# EAGLE design TeslaBMS_Shield (EAGLE 6.6.0)
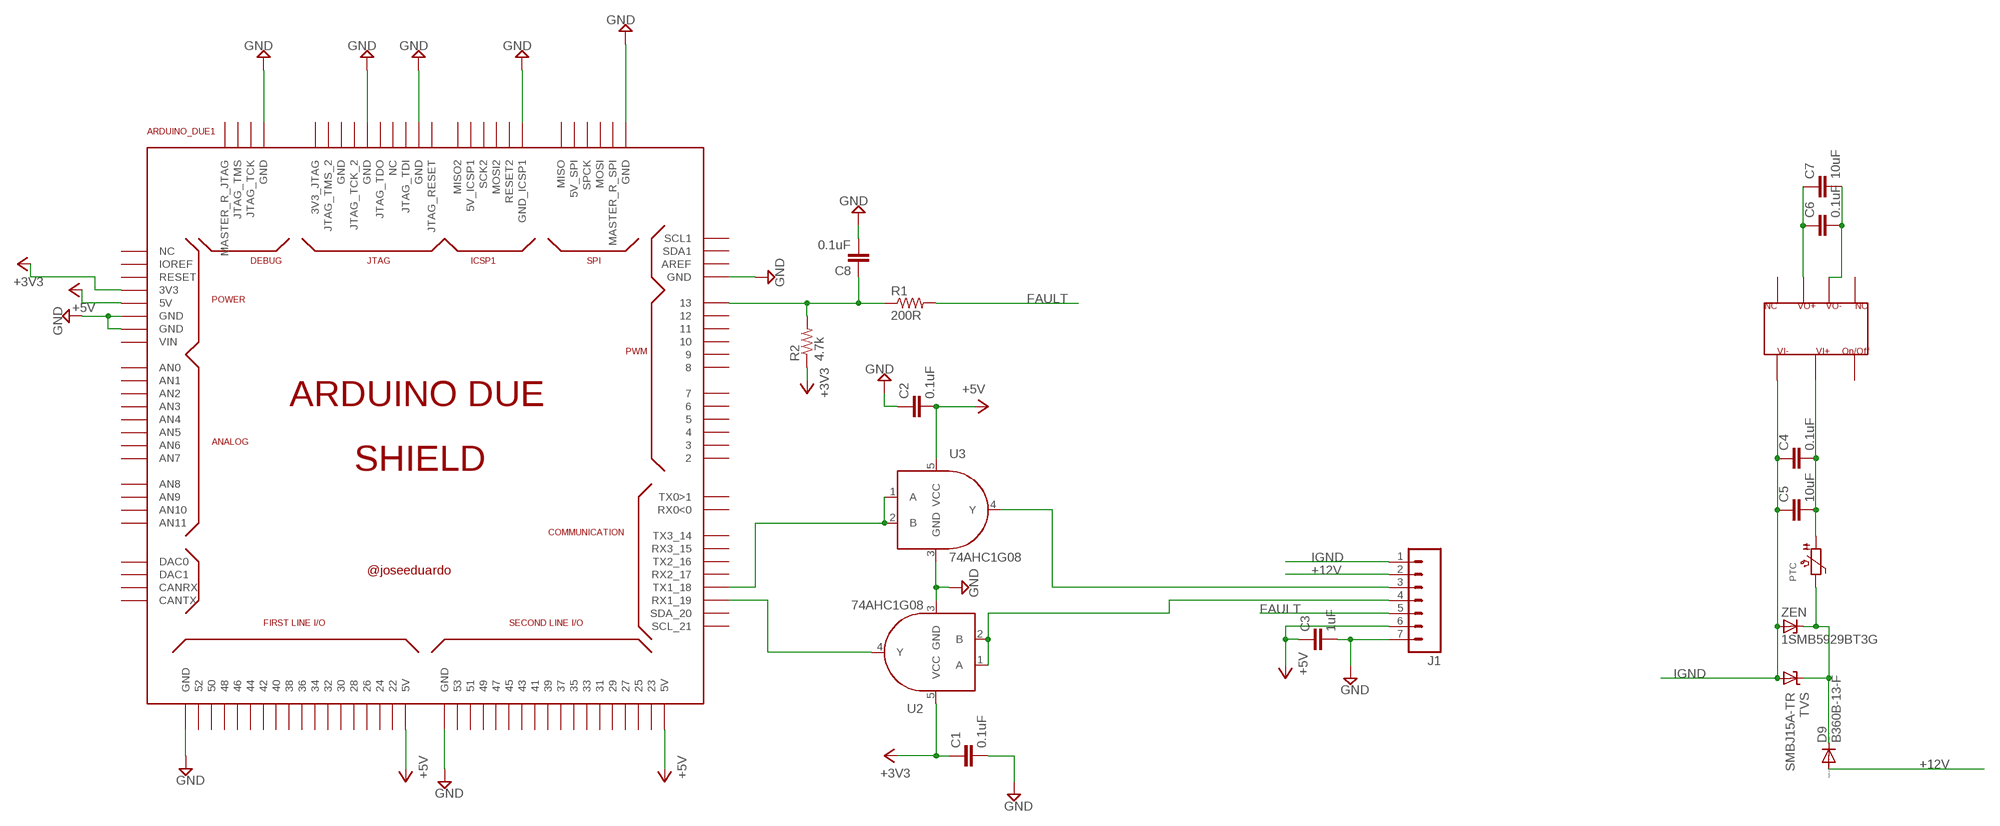
[diagram p0: schematic, sheet 1]

## Parts
ARDUINO_DUE1  ARDUINO_DUE_SHIELD  [ARDUINO_DUE_SHIELD]
C1  0.1uF  CAP0603-CAP  [0603-CAP]
C2  0.1uF  CAP0603-CAP  [0603-CAP]
C3  1uF  CAP0603-CAP  [0603-CAP]
C4  0.1uF  CAP0805  [0805]
C5  10uF  CAP0805  [0805]
C6  0.1uF  CAP0805  [0805]
C7  10uF  CAP0805  [0805]
C8  0.1uF  CAP0603-CAP  [0603-CAP]
D9  B360B-13-F  DIODE-SMB  [SMB]
J1  M07LONGPADS  [1X07_LONGPADS]
PTC  PTC1812  [PTC1812]
R1  200R  RESISTOR0603-RES  [0603-RES]
R2  4.7k  RESISTOR0603-RES  [0603-RES]
TVS  SMBJ15A-TR  SUPPRESSOR-SMBJ  [SMBJ]
U1  CINCON5V  [CINCON5V]
U2  74AHC1G08  [SOT353]
U3  74AHC1G08  [SOT353]
ZEN  1SMB5929BT3G  ZENER-DIODESMB  [SMB]

## Nets
+3V3: ARDUINO_DUE1.3V3 C1.1 R2.1 U2.5(VCC)
+5V: ARDUINO_DUE1.5V0(5V) ARDUINO_DUE1.5V0_1(5V) ARDUINO_DUE1.5V0_2(5V) C2.2 C3.1 C6.1 C7.1 J1.6 U1.P$5 U3.5(VCC)
+12V: D9.A J1.2
FAULT: J1.5 R1.2
GND: ARDUINO_DUE1.GND ARDUINO_DUE1.GND_1(GND) ARDUINO_DUE1.GND_2(GND) ARDUINO_DUE1.GND_3(GND) ARDUINO_DUE1.GND_4(GND) ARDUINO_DUE1.GND_5(GND) ARDUINO_DUE1.GND_7(GND) ARDUINO_DUE1.GND_9(GND) ARDUINO_DUE1.GND_10(GND) ARDUINO_DUE1.GND_ICSP1 C1.2 C2.1 C3.2 C6.2 C7.2 C8.2 J1.7 U1.P$6 U2.3(GND) U3.3(GND)
IGND: C4.1 C5.1 J1.1 TVS.A U1.P$1 ZEN.A
N$1: D9.C PTC.P$2 TVS.C ZEN.C
N$2: ARDUINO_DUE1.19(RX1_19) U2.4(Y)
N$3: ARDUINO_DUE1.18(TX1_18) U3.1(A) U3.2(B)
N$4: J1.3 U3.4(Y)
N$5: J1.4 U2.1(A) U2.2(B)
N$6: C4.2 C5.2 PTC.P$1 U1.P$2
N$7: ARDUINO_DUE1.13 C8.1 R1.1 R2.2
Unconnected: ARDUINO_DUE1.0(RX0<0) ARDUINO_DUE1.1(TX0>1) ARDUINO_DUE1.2 ARDUINO_DUE1.3 ARDUINO_DUE1.3V3_JTAG ARDUINO_DUE1.4 ARDUINO_DUE1.5 ARDUINO_DUE1.5V_2(5V_SPI) ARDUINO_DUE1.5V_ICSP1 ARDUINO_DUE1.6 ARDUINO_DUE1.7 ARDUINO_DUE1.8 ARDUINO_DUE1.9 ARDUINO_DUE1.10 ARDUINO_DUE1.11 ARDUINO_DUE1.12 ARDUINO_DUE1.14(TX3_14) ARDUINO_DUE1.15(RX3_15) ARDUINO_DUE1.16(TX2_16) ARDUINO_DUE1.17(RX2_17) ARDUINO_DUE1.20(SDA_20) ARDUINO_DUE1.21(SCL_21) ARDUINO_DUE1.22 ARDUINO_DUE1.23 ARDUINO_DUE1.24 ARDUINO_DUE1.25 ARDUINO_DUE1.26 ARDUINO_DUE1.27 ARDUINO_DUE1.28 ARDUINO_DUE1.29 ARDUINO_DUE1.30 ARDUINO_DUE1.31 ARDUINO_DUE1.32 ARDUINO_DUE1.33 ARDUINO_DUE1.34 ARDUINO_DUE1.35 ARDUINO_DUE1.36 ARDUINO_DUE1.37 ARDUINO_DUE1.38 ARDUINO_DUE1.39 ARDUINO_DUE1.40 ARDUINO_DUE1.41 ARDUINO_DUE1.42 ARDUINO_DUE1.43 ARDUINO_DUE1.44 ARDUINO_DUE1.45 ARDUINO_DUE1.46 ARDUINO_DUE1.47 ARDUINO_DUE1.48 ARDUINO_DUE1.49 ARDUINO_DUE1.50 ARDUINO_DUE1.51 ARDUINO_DUE1.52 ARDUINO_DUE1.53 ARDUINO_DUE1.A0(AN0) ARDUINO_DUE1.A1(AN1) ARDUINO_DUE1.A2(AN2) ARDUINO_DUE1.A3(AN3) ARDUINO_DUE1.A4(AN4) ARDUINO_DUE1.A5(AN5) ARDUINO_DUE1.A6(AN6) ARDUINO_DUE1.A7(AN7) ARDUINO_DUE1.A8(AN8) ARDUINO_DUE1.A9(AN9) ARDUINO_DUE1.A10(AN10) ARDUINO_DUE1.A11(AN11) ARDUINO_DUE1.AREF ARDUINO_DUE1.CANRX ARDUINO_DUE1.CANTX ARDUINO_DUE1.DAC0 ARDUINO_DUE1.DAC1 ARDUINO_DUE1.GND_8(GND) ARDUINO_DUE1.IOREF ARDUINO_DUE1.JTAG_RESET ARDUINO_DUE1.JTAG_TCK ARDUINO_DUE1.JTAG_TCK_2 ARDUINO_DUE1.JTAG_TDI ARDUINO_DUE1.JTAG_TDO ARDUINO_DUE1.JTAG_TMS ARDUINO_DUE1.JTAG_TMS_2 ARDUINO_DUE1.MASTER_RESET_JTAG(MASTER_R_JTAG) ARDUINO_DUE1.MASTER_RESET_SPI(MASTER_R_SPI) ARDUINO_DUE1.MISO ARDUINO_DUE1.MISO2 ARDUINO_DUE1.MOSI ARDUINO_DUE1.MOSI2 ARDUINO_DUE1.NC_2(NC) ARDUINO_DUE1.NC_5(NC) ARDUINO_DUE1.RESET ARDUINO_DUE1.RESET2 ARDUINO_DUE1.SCK2 ARDUINO_DUE1.SCL1 ARDUINO_DUE1.SDA1 ARDUINO_DUE1.SPCK ARDUINO_DUE1.VIN U1.P$3 U1.P$4 U1.P$7

## Library data of the parts
ARDUINO_DUE1 = arduino_due_shield:ARDUINO_DUE_SHIELD
C1-C8 = SparkFun-Passives:CAP: Capacitor Standard 0603 ceramic capacitor, and 0.1" leaded capacitor.
D9 = diode:DIODE-: DIODE
J1 = SparkFun-Connectors:M07: Header 7 Standard 7-pin 0.1" header. Use with straight break away headers (SKU : PRT-00116), right angle break away headers (PRT-00553), swiss pins (PRT-00743), machine pins (PRT-00117), and female headers (PRT-00115). NOTES ON THE VARIANTS LOCK and LOCK_LONGPADS... This footprint was designed to help hold the alignment of a through-hole component (i.e. 7-pin header) while soldering it into place. You may notice that each hole has been shifted either up or down by 0.005 of an inch from it's more standard position (which is usually a perfectly straight line). This slight alteration caused the pins (the squares in the middle) to touch the edges of the holes. Because they are alternating, it causes a "brace" to hold the header in place. 0.005 has proven to be the perfect amount of "off-center" position when using our standard breakaway headers. Although looks a little odd when you look at the bare footprint, once you have a header in there, the alteration is very hard to notice. Also, if you push a header all the way into place, it is covered up entirely on the bottom side. This idea of altering the position of holes to aid alignment will be further integrated into the Sparkfun Library for other footprints. It can help hold any component with 3 or more connection pins.
PTC = microbuilder:PTC: PTC (Resettable Fuse) 1206 Package 250mA PTC (16V Max, Time-to-Trip: 0.08s) - Digikey: F2110CT-ND 1210 Package 100mA PTC (30V Max, Time-to-Trip: 0.6s) - Digikey: MF-USMF010-2CT-ND 1812 Package 750mA PTC (24V Max, Time-to-Trip: 0.2s) - Digikey: MF-MSMF075/24-2CT-ND
R1 R2 = SparkFun-Passives:RESISTOR: Resistor Basic schematic elements and footprints for 0603, 1206, and PTH resistors.
TVS = diode:SUPPRESSOR-: Suppressor diode
U1 = collin:CINCON5V
U2 U3 = SparkFun-DigitalIC:74AHC1G08: Single 2-input AND gate; PROD_ID: IC-10841
ZEN = diode:ZENER-DIODE: Z-Diode

## Net classes
0 default: width 0.203 mm, drill 0.305 mm, clearance 0.203 mm

## Board
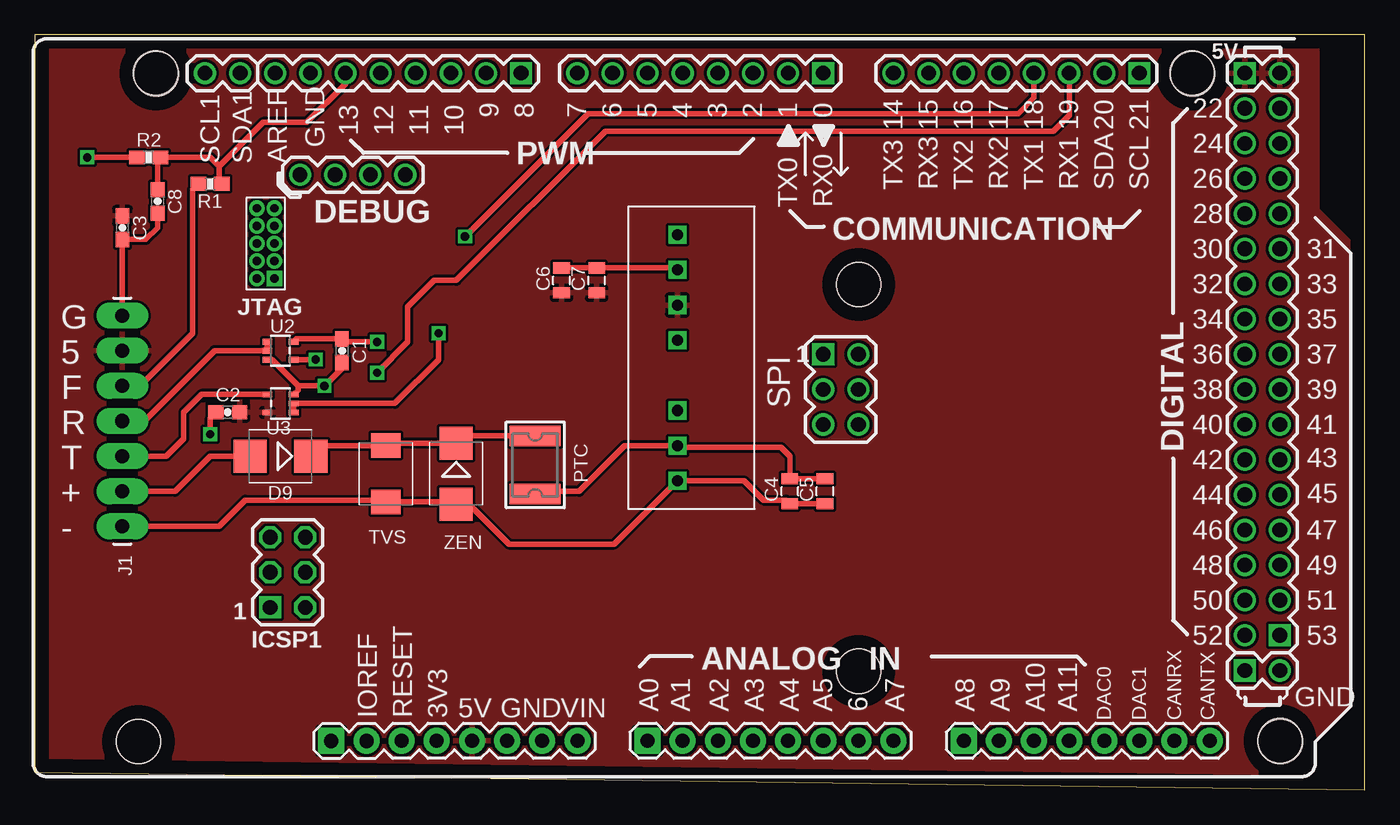
[diagram p1: board, top side]
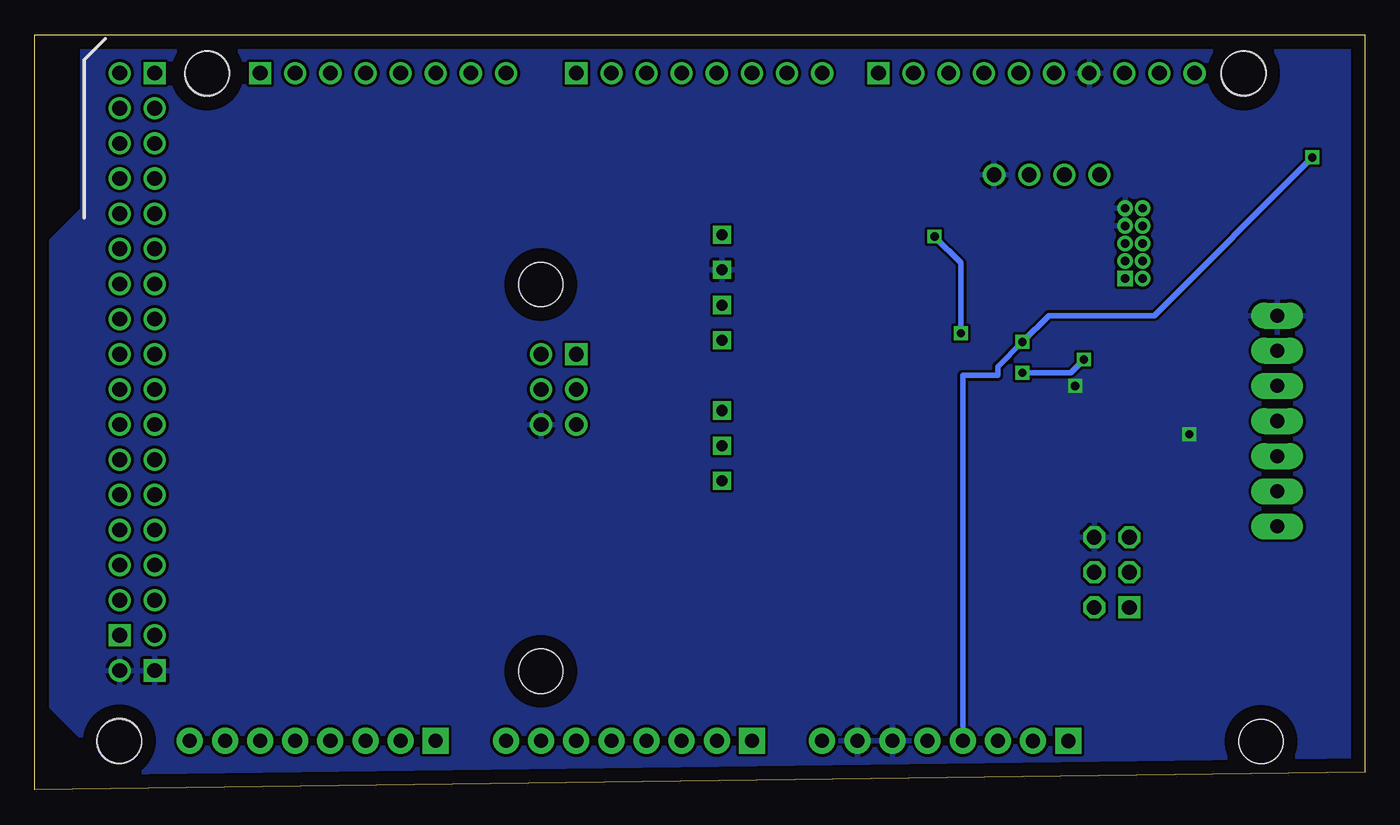
[diagram p2: board, bottom side, seen from below]

Size 96.19 x 54.6 mm. Coordinates in mm from the lower left corner, seen from the top.
Outline: 0,1.27 96.19,0 96.19,54.6 0,54.6 0,1.27
Copper layers (1*16): Top 0.035mm / dielectric 1.5mm / Bottom 0.035mm
Design rules "default": minimum track width 10mil, minimum drill 24mil, track to track 8mil, track to pad 8mil, pad to pad 8mil, via to via 8mil, smd to smd 8mil, copper to edge 40mil, drill to drill 8mil, minimum pad ring 10mil, minimum via ring 8mil, stop-mask expansion 4mil, vias tented up to drill 0mil, thermal gap 10mil

### Footprints (pad centres in the part's own frame; a part is rotated, then mirrored left to right if it is on the bottom)
ARDUINO_DUE_SHIELD = drill 1.067 square: 0 63.373,51.816; 5V0_1 93.853,51.816; 8 41.529,51.816; 21 86.233,51.816; 53 96.393,11.176; GND_2 93.853,8.636; MISO 63.373,31.496; MISO2 23.384,13.196 | drill 1.067: 1 60.833,51.816; 2 58.293,51.816; 3 55.753,51.816; 4 53.213,51.816; 5 50.673,51.816; 5V0_2 96.393,51.816; 5V_2 65.913,31.496; 6 48.133,51.816; 7 45.593,51.816; 9 38.989,51.816; 10 36.449,51.816; 11 33.909,51.816; 12 31.369,51.816; 13 28.829,51.816; 14 68.453,51.816; 15 70.993,51.816; 16 73.533,51.816; 17 76.073,51.816; 18 78.613,51.816; 19 81.153,51.816; 20 83.693,51.816; 22 93.853,49.276; 23 96.393,49.276; 24 93.853,46.736; 25 96.393,46.736; 26 93.853,44.196; 27 96.393,44.196; 28 93.853,41.656; 29 96.393,41.656; 30 93.853,39.116; 31 96.393,39.116; 32 93.853,36.576; 33 96.393,36.576; 34 93.853,34.036; 35 96.393,34.036; 36 93.853,31.496; 37 96.393,31.496; 38 93.853,28.956; 39 96.393,28.956; 40 93.853,26.416; 41 96.393,26.416; 42 93.853,23.876; 43 96.393,23.876; 44 93.853,21.336; 45 96.393,21.336; 46 93.853,18.796; 47 96.393,18.796; 48 93.853,16.256; 49 96.393,16.256; 50 93.853,13.716; 51 96.393,13.716; 52 93.853,11.176; AREF 23.749,51.816; GND_3 96.393,8.636; GND_4 26.289,51.816; GND_5 65.913,26.416; GND_7 33.161,44.473; JTAG_TCK 30.621,44.473; JTAG_TMS 28.081,44.473; MASTER_RESET_JTAG 25.541,44.473; MASTER_RESET_SPI 63.373,26.416; MOSI 65.913,28.956; SCL1 18.669,51.816; SDA1 21.209,51.816; SPCK 63.373,28.956 | drill 1.016 pad 1.88: 3V3 35.433,3.556; 5V0 37.973,3.556; A1 53.213,3.556; A2 55.753,3.556; A3 58.293,3.556; A4 60.833,3.556; A5 63.373,3.556; A6 65.913,3.556; A7 68.453,3.556; A9 76.073,3.556; A10 78.613,3.556; A11 81.153,3.556; CANRX 88.773,3.556; CANTX 91.313,3.556; DAC0 83.693,3.556; DAC1 86.233,3.556; GND 40.513,3.556; GND_1 43.053,3.556; IOREF 30.346,3.543; RESET 32.893,3.555; VIN 45.593,3.556 | drill 0.6 pad 1.016 square: 3V3_JTAG 23.689,36.964 | drill 1.067 octagon: 5V_ICSP1 25.924,13.196; GND_ICSP1 25.924,18.276; MOSI2 25.924,15.736; RESET2 23.384,18.276; SCK2 23.384,15.736 | drill 1.016 pad 1.88 square: A0 50.673,3.556; A8 73.533,3.556; NC_2 27.806,3.543 | drill 0.6 pad 1.143: GND_8 23.689,38.234; GND_9 23.689,40.774; GND_10 23.689,42.044; JTAG_RESET 22.419,42.044; JTAG_TCK_2 22.419,38.234; JTAG_TDI 22.419,40.774; JTAG_TDO 22.419,39.504; JTAG_TMS_2 22.419,36.964; NC_5 23.689,39.504 | hole 3.2: 15.113,51.816; 90.043,51.816; 96.393,3.556; 96.418,3.505; 15.138,51.765; 90.068,51.765; 13.868,3.505; 65.938,36.525; 65.938,8.585
0603-CAP = smd 1.1 x 1: 1 -0.85,0; 2 0.85,0
0805 = smd 0.8 x 1.2: 1 -0.9,0; 2 0.9,0
SMB = smd 2.4 x 2.4: A 2.2,0; C -2.2,0
1X07_LONGPADS = drill 1.016 pad 1.88 long: 1 0,0; 2 2.54,0; 3 5.08,0; 4 7.62,0; 5 10.16,0; 6 12.7,0; 7 15.24,0
PTC1812 = smd 1.5 x 3.7: P$1 -2.1,0; P$2 2.1,0
0603-RES = smd 1.1 x 1: 1 -0.85,0; 2 0.85,0
SMBJ = smd 1.78 x 2.16: A 2.04,0; C -2.03,0
CINCON5V = drill 0.8 square: P$1 2.032,5.588; P$2 4.572,5.588; P$3 7.112,5.588; P$4 12.192,5.588; P$5 14.732,5.588; P$6 17.272,5.588; P$7 19.812,5.588
SOT353 = smd 0.42 x 0.7: 1 -0.65,-0.95; 2 0,-0.95; 3 0.65,-0.95; 4 0.65,0.95; 5 -0.65,0.95

### Placement (x,y rotation side)
ARDUINO_DUE1  -6.35,0 0 top
C1  22.23,31.75 270 top
C2  13.97,27.3 0 top
C3  6.35,40.64 270 top
C4  54.61,21.59 90 top
C5  57.15,21.59 90 top
C6  38.1,36.83 90 top
C7  40.64,36.83 90 top
C8  8.89,42.55 270 top
D9  17.78,24.13 180 top
J1  6.35,19.05 90 top
PTC  36.2,23.5 90 top
R1  12.7,43.81 180 top
R2  8.26,45.72 0 top
TVS  25.4,22.86 270 top
U1  52.07,20.32 90 top
U2  17.78,31.75 270 top
U3  17.78,27.94 90 top
ZEN  30.48,22.86 270 top

### Tracks (layer width: path | path; a pad name or v marks a point on that pad's centre or on a via)
+3V3  (via drill 0.6)
  Top 0.406: U2.5 18.93,32.6 C1.1 22.44,32.38 v24.77,32.38 | v3.81,45.72 R2.1
  Bottom 0.406: ARDUINO_DUE1.3V3 29.08,29.97 26.54,29.97 26.54,30.61 v24.77,32.38 22.86,34.29 15.24,34.29 v3.81,45.72
+5V
  pour Top: 0,54.61 92.71,54.61 92.71,41.91 95.25,39.37 95.25,6.35 92.71,3.81 92.71,1.27 0,1.27
+12V
  Top 0.406: D9.A 12.7,24.13 10.16,21.59 J1.2
FAULT
  Top 0.406: J1.5 7.62,29.21 11.43,33.02 11.43,43.4 R1.2
GND  (via drill 0.6)
  Top 0.406: C6.2 C7.2 46.34,37.73 U1.P$6 | J1.7 C3.2 8.04,39.79 8.89,40.64 C8.2 | U2.3 17.16,31.1 19.05,29.21 | 19.05,29.21 19.05,28.91 U3.3 | C1.2 22.23,30.48 v20.95,29.21 19.05,29.21 | v12.7,25.72 12.7,26.89 C2.1
  pour Bottom: 0,54.61 92.71,54.61 92.71,41.91 95.25,39.37 95.25,6.35 92.71,3.81 92.71,1.27 0,1.27
IGND
  Top 0.406: J1.1 13.33,19.05 15.24,20.95 25.27,20.95 TVS.A 30.32,20.82 ZEN.A 31.41,20.66 34.29,17.78 41.91,17.78 U1.P$1 51.31,22.35 52.7,20.95 54.34,20.95 C4.1 C5.1
N$1
  Top 0.406: PTC.P$2 31.02,25.59 ZEN.C 25.57,25.06 TVS.C 20.74,24.89 D9.C
N$2  (via drill 0.6)
  Top 0.406: ARDUINO_DUE1.19 74.8,48.77 73.66,47.62 41.27,47.62 30.48,36.83 28.89,36.83 26.99,34.92 26.99,32.38 v24.77,30.16 | v20.32,31.11 18.74,31.11 U2.4
  Bottom 0.406: v24.77,30.16 21.27,30.16 v20.32,31.11
N$3  (via drill 0.6)
  Top 0.406: ARDUINO_DUE1.18 72.26,50.04 71.12,48.9 40,48.9 v31.12,40.01 | U3.1 U3.2 26.03,27.94 29.21,31.11 v29.21,33.02
  Bottom 0.406: v31.12,40.01 29.21,38.1 v29.21,33.02
N$4
  Top 0.406: U3.4 12.08,28.59 10.79,27.3 10.79,25.4 9.53,24.13 J1.3
N$5
  Top 0.406: U2.1 U2.2 13.02,31.75 7.94,26.67 J1.4
N$6
  Top 0.406: C5.2 C4.2 54.61,24.13 53.98,24.77 46.61,24.77 U1.P$2 42.67,24.89 39.37,21.59 36.39,21.59 PTC.P$1
N$7
  Top 0.406: ARDUINO_DUE1.13 22.48,51.05 19.69,48.26 16.51,48.26 13.33,45.09 | 13.33,45.09 13.33,44.03 R1.1 | C8.1 8.89,45.51 R2.2 12.7,45.72 13.33,45.09

### Text on the board
tNames: G | 5 | F | R | T | + | -